# EAGLE schematic opto_isolator (EAGLE 4.16)
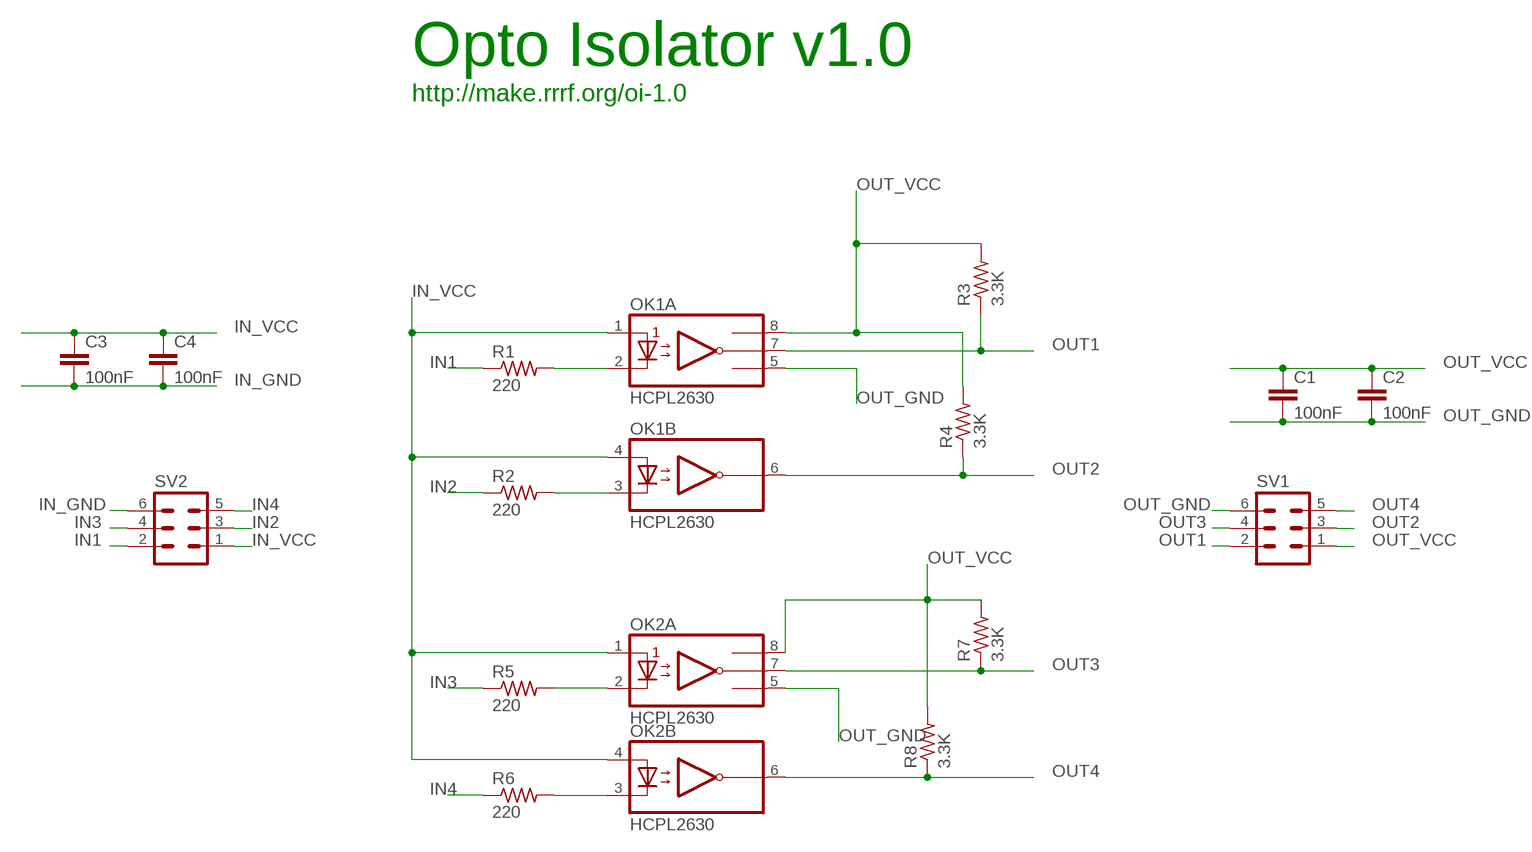
[diagram p0: schematic, sheet 1]

## Parts
C1  100nF  C-EU050-035X075  [C050-035X075]
C2  100nF  C-EU050-035X075  [C050-035X075]
C3  100nF  C-EU050-035X075  [C050-035X075]
C4  100nF  C-EU050-035X075  [C050-035X075]
OK1  HCPL2630  [DIL08]
OK2  HCPL2630  [DIL08]
R1  220  R-US_0207/2V  [0207/2V]
R2  220  R-US_0207/2V  [0207/2V]
R3  3.3K  R-US_0207/2V  [0207/2V]
R4  3.3K  R-US_0207/2V  [0207/2V]
R5  220  R-US_0207/2V  [0207/2V]
R6  220  R-US_0207/2V  [0207/2V]
R7  3.3K  R-US_0207/2V  [0207/2V]
R8  3.3K  R-US_0207/2V  [0207/2V]
SV1  ML6  [ML6]
SV2  ML6  [ML6]

## Nets
IN1: R1.1 SV2.2
IN2: R2.1 SV2.3
IN3: R5.1 SV2.4
IN4: R6.1 SV2.5
IN_GND: C3.2 C4.2 SV2.6
IN_VCC: C3.1 C4.1 OK1.1(A:A1) OK1.4(B:A2) OK2.1(A:A1) OK2.4(B:A2) SV2.1
N$1: OK2.2(A:C1) R5.2
N$3: OK1.2(A:C1) R1.2
N$4: OK1.3(B:C2) R2.2
N$6: OK2.3(B:C2) R6.2
OUT1: OK1.7(A:VO1) R3.1 SV1.2
OUT2: OK1.6(B:VO2) R4.1 SV1.3
OUT3: OK2.7(A:VO1) R7.1 SV1.4
OUT4: OK2.6(B:VO2) R8.1 SV1.5
OUT_GND: C1.2 C2.2 OK1.5(A:GND) OK2.5(A:GND) SV1.6
OUT_VCC: C1.1 C2.1 OK1.8(A:VCC) OK2.8(A:VCC) R3.2 R4.2 R7.2 R8.2 SV1.1

## Notes on the sheet
- Opto Isolator v1.0
- http://make.rrrf.org/oi-1.0

## Library data of the parts
C1-C4 = rcl:C-EU: CAPACITOR, European symbol
OK1 OK2 = optocoupler:HCPL2630: HEWLETT PACKARD OPTO COUPLER
R1-R8 = rcl:R-US_: RESISTOR, American symbol
SV1 SV2 = con-harting-ml:ML6: HARTING